# Altium project oled_mod.PrjPCB
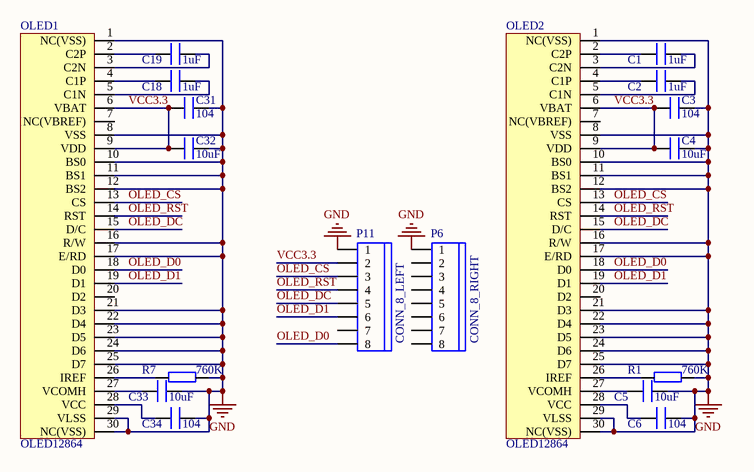
[diagram p0: oled_mod.SchDoc]
1 sheet, 18 parts. Net scope: global (net labels, ports and power ports of the same name join across sheets).
Board file: oled_mod.PcbDoc

## Sheet oled_mod.SchDoc: MiniFly
size A4; Author: liujun6037; Revision: 0; Version: V1.32; SheetSize: A4

### Parts
C1  1uF  [C 0603_L]
C2  1uF  [C 0603_L]
C3  104  [C 0603_L]
C4  10uF  [C 0603_L]
C5  10uF  [C 0603_L]
C6  104  [C 0603_L]
C18  1uF  [C 0603_L]
C19  1uF  [C 0603_L]
C31  104  [C 0603_L]
C32  10uF  [C 0603_L]
C33  10uF  [C 0603_L]
C34  104  [C 0603_L]
OLED1  OLED12864  [OLED_0.96]
OLED2  OLED12864  [OLED_0.96]
P6  CONN_8_RIGHT  [HEADER8-2.0MM]
P11  CONN_8_LEFT  [HEADER8-2.0MM]
R1  760K  [R 0603_L]
R7  760K  [R 0603_L]

### Nets
GND: C3.1 C4.1 C5.1 C6.1 C31.1 C32.1 C33.1 C34.1 OLED1.1(NC(VSS)) OLED1.8(VSS) OLED1.10(BS0) OLED1.11(BS1) OLED1.12(BS2) OLED1.16(R/W) OLED1.17(E/RD) OLED1.21(D3) OLED1.22(D4) OLED1.23(D5) OLED1.24(D6) OLED1.25(D7) OLED1.29(VLSS) OLED1.30(NC(VSS)) OLED2.1(NC(VSS)) OLED2.8(VSS) OLED2.10(BS0) OLED2.11(BS1) OLED2.12(BS2) OLED2.16(R/W) OLED2.17(E/RD) OLED2.21(D3) OLED2.22(D4) OLED2.23(D5) OLED2.24(D6) OLED2.25(D7) OLED2.29(VLSS) OLED2.30(NC(VSS)) P6.1 P11.1 R1.1 R7.1
OLED_CS: OLED1.13(CS) OLED2.13(CS) P11.3
OLED_D0: OLED1.18(D0) OLED2.18(D0) P11.8
OLED_D1: OLED1.19(D1) OLED2.19(D1) P11.6
OLED_DC: OLED1.15(D/C) OLED2.15(D/C) P11.5
OLED_RST: OLED1.14(RST) OLED2.14(RST) P11.4
VCC3.3: C3.2 C4.2 C31.2 C32.2 OLED1.6(VBAT) OLED1.9(VDD) OLED2.6(VBAT) OLED2.9(VDD) P11.2
NetC1_1: C1.1 OLED2.3(C2N)
NetC1_2: C1.2 OLED2.2(C2P)
NetC2_1: C2.1 OLED2.5(C1N)
NetC2_2: C2.2 OLED2.4(C1P)
NetC5_2: C5.2 OLED2.27(VCOMH)
NetC6_2: C6.2 OLED2.28(VCC)
NetC18_1: C18.1 OLED1.5(C1N)
NetC18_2: C18.2 OLED1.4(C1P)
NetC19_1: C19.1 OLED1.3(C2N)
NetC19_2: C19.2 OLED1.2(C2P)
NetC33_2: C33.2 OLED1.27(VCOMH)
NetC34_2: C34.2 OLED1.28(VCC)
NetOLED1_26: OLED1.26(IREF) R7.2
NetOLED2_26: OLED2.26(IREF) R1.2

Not connected (* = marked no-connect by the designer): OLED1 7(NC(VBREF)) 20(D2); OLED2 7(NC(VBREF)) 20(D2); P6 2 3 4 5 6 7 8; P11 7

### Notes on the sheet
- Title:
- Author:
- Date:
- Revision:
- lycreturn@ALIENTEK
- Size:
- File:
- Version:

### Library data of the parts
C1-C6 C18 C19 C31-C34 = C
P6 P11 = HEAD8
R1 R7 = R